# EAGLE design Motor-Driver-Breakout (EAGLE 9.6.2)
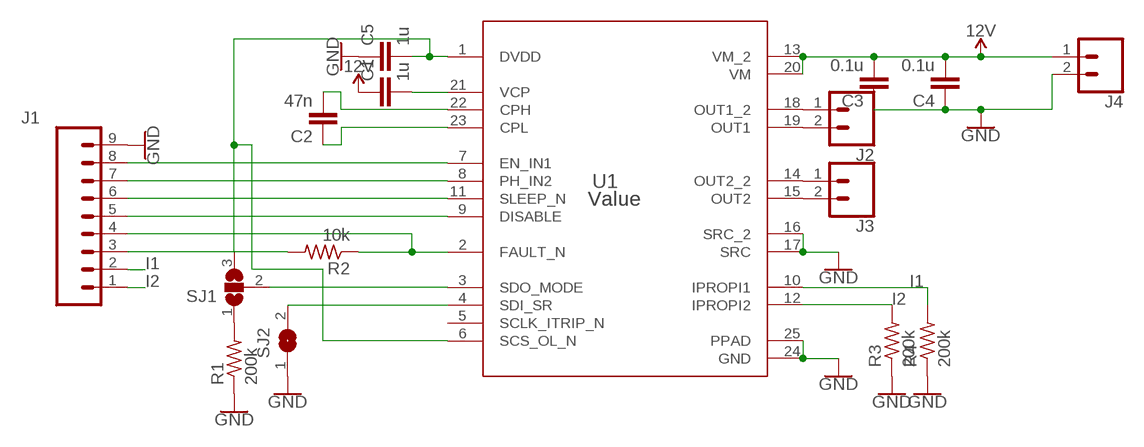
[diagram p0: schematic, sheet 1]

## Parts
C1  1u  C0603  [0603-C]
C2  47n  C0603  [0603-C]
C3  0.1u  C0603  [0603-C]
C4  0.1u  C0603  [0603-C]
C5  1u  C0603  [0603-C]
J1  CONN_09  [1X09]
J2  CONN_02  [1X02]
J3  CONN_02  [1X02]
J4  CONN_02  [1X02]
R1  200k  R0603  [0603-R]
R2  10k  R0603  [0603-R]
R3  200k  R0603  [0603-R]
R4  200k  R0603  [0603-R]
SJ1  SJ2W  [SJ_2]
SJ2  SJ  [SJ]
U1  Value  DRV8873HPWPRQ1  [PWP0024J_N]

## Nets
12V: C1.1 C3.2 C4.2 J4.1 U1.13(VM_2) U1.20(VM)
GND: C3.1 C4.1 C5.1 J1.9 J4.2 R1.1 R3.1 R4.1 SJ2.1 U1.16(SRC_2) U1.17(SRC) U1.24(GND) U1.25(PPAD)
I1: J1.2 R4.2 U1.10(IPROPI1)
I2: J1.1 R3.2 U1.12(IPROPI2)
N$1: SJ1.2 U1.3(SDO_MODE)
N$2: R1.2 SJ1.1
N$3: J1.4 R2.1 U1.2(FAULT_N)
N$4: C5.2 SJ1.3 U1.1(DVDD) U1.6(SCS_OL_N)
N$5: C1.2 U1.21(VCP)
N$6: C2.2 U1.22(CPH)
N$7: C2.1 U1.23(CPL)
N$8: J2.1 U1.18(OUT1_2)
N$9: SJ2.2 U1.4(SDI_SR)
N$10: J2.2 U1.19(OUT1)
N$11: J1.6 U1.11(SLEEP_N)
N$12: J1.8 U1.7(EN_IN1)
N$13: J1.7 U1.8(PH_IN2)
N$14: J1.5 U1.9(DISABLE)
N$15: J1.3 R2.2
N$16: J3.1 U1.14(OUT2_2)
N$17: J3.2 U1.15(OUT2)
Unconnected: U1.5(SCLK_ITRIP_N)

## Library data of the parts
C1-C5 = comma.ai:C
J1 = SparkFun-Connectors:CONN_09: Multi connection point. Often used as Generic Header-pin footprint for 0.1 inch spaced/style header connections On any of the 0.1 inch spaced packages, you can populate with these: Break Away Headers - Straight <https://www.sparkfun.com/products/116> (PRT-00116) Break Away Male Headers - Right Angle <https://www.sparkfun.com/products/553> (PRT-00553) Female Headers <https://www.sparkfun.com/products/115> (PRT-00115) Break Away Headers - Machine Pin <https://www.sparkfun.com/products/117> (PRT-00117) Break Away Female Headers - Swiss Machine Pin <https://www.sparkfun.com/products/743> (PRT-00743) For SCREWTERMINALS and SPRING TERMINALS visit here: Screw Terimnals on SparkFun.com <https://www.sparkfun.com/search/results?term=Screw+Terminals> (5mm/3.5mm/2.54mm spacing) This device is also useful as a general connection point to wire up your design to another part of your project. Our various solder wires solder well into these plated through hole pads. Hook-Up Wire - Assortment (Stranded, 22 AWG) <https://www.sparkfun.com/products/11375> (PRT-11375) Hook-Up Wire - Assortment (Solid Core, 22 AWG) <https://www.sparkfun.com/products/11367> (PRT-11367) View the entire wire category on our website here <https://www.sparkfun.com/categories/141> Special notes: Molex polarized connector foot print use with SKU : PRT-08231 with associated crimp pins and housings. 1MM SMD Version SKU: PRT-10208 NOTES ON THE VARIANTS LOCK and LOCK_LONGPADS... This footprint was designed to help hold the alignment of a through-hole component (i.e. 6-pin header) while soldering it into place. You may notice that each hole has been shifted either up or down by 0.005 of an inch from it's more standard position (which is a perfectly straight line). This slight alteration caused the pins (the squares in the middle) to touch the edges of the holes. Because they are alternating, it causes a "brace" to hold the component in place. 0.005 has proven to be the perfect amount of "off-center" position when using our standard breakaway headers. Although looks a little odd when you look at the bare footprint, once you have a header in there, the alteration is very hard to notice. Also,if you push a header all the way into place, it is covered up entirely on the bottom side.
J2-J4 = SparkFun-Connectors:CONN_02: Multi connection point. Often used as Generic Header-pin footprint for 0.1 inch spaced/style header connections On any of the 0.1 inch spaced packages, you can populate with these: Break Away Headers - Straight <https://www.sparkfun.com/products/116> (PRT-00116) Break Away Male Headers - Right Angle <https://www.sparkfun.com/products/553> (PRT-00553) Female Headers <https://www.sparkfun.com/products/115> (PRT-00115) Break Away Headers - Machine Pin <https://www.sparkfun.com/products/117> (PRT-00117) Break Away Female Headers - Swiss Machine Pin <https://www.sparkfun.com/products/743> (PRT-00743) For SCREWTERMINALS and SPRING TERMINALS visit here: Screw Terimnals on SparkFun.com <https://www.sparkfun.com/search/results?term=Screw+Terminals> (5mm/3.5mm/2.54mm spacing) This device is also useful as a general connection point to wire up your design to another part of your project. Our various solder wires solder well into these plated through hole pads. Hook-Up Wire - Assortment (Stranded, 22 AWG) <https://www.sparkfun.com/products/11375> (PRT-11375) Hook-Up Wire - Assortment (Solid Core, 22 AWG) <https://www.sparkfun.com/products/11367> (PRT-11367) View the entire wire category on our website here <https://www.sparkfun.com/categories/141> Special notes: Molex polarized connector foot print use with: PRT-08233 with associated crimp pins and housings. 2.54_SCREWTERM for use with PRT-10571. 3.5mm Screw Terminal footprints for PRT-08084 5mm Screw Terminal footprints for use with PRT-08432
R1-R4 = comma.ai:R
SJ1 = jumper:SJ2W: SMD solder JUMPER
SJ2 = jumper:SJ: SMD solder JUMPER
U1 = comma.ai:DRV8873HPWPRQ1; MANUFACTURER: Texas Instruments; PARTNUMBER: DRV8873SPWPRQ1; REFDES: RefDes; TYPE: TYPE

## Board
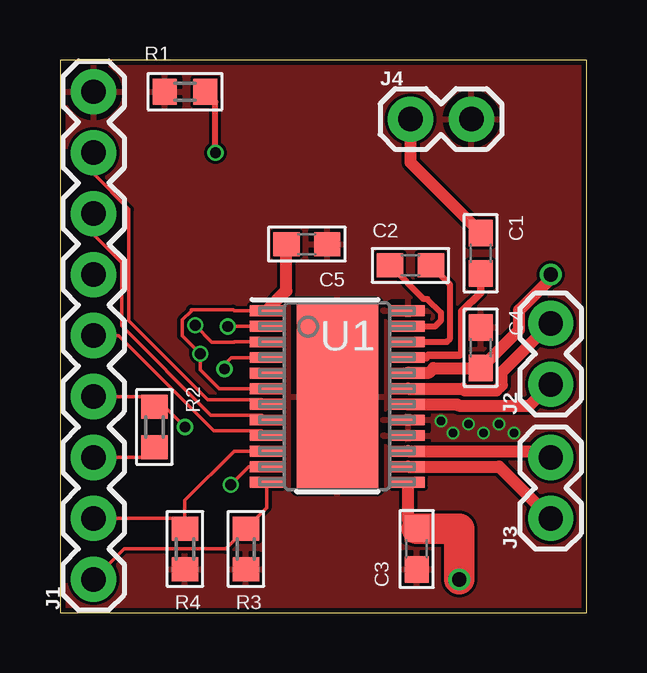
[diagram p1: board, top side]
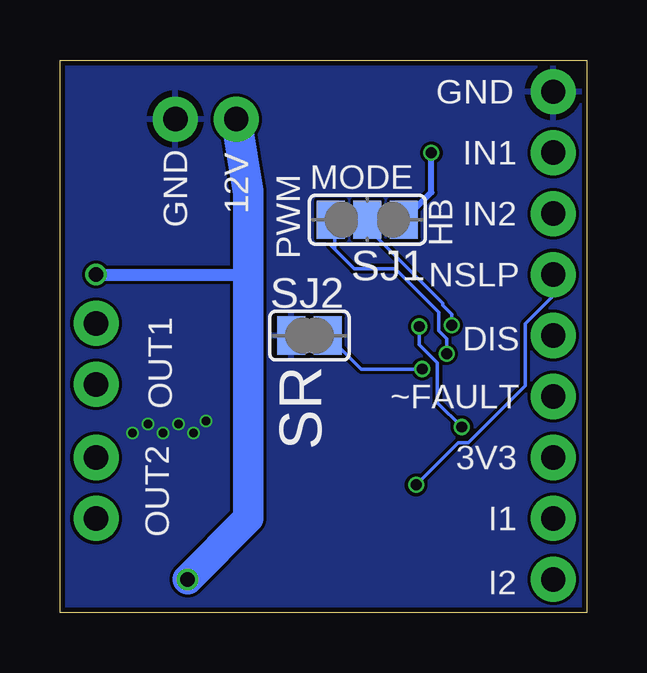
[diagram p2: board, bottom side, seen from below]

Size 21.95 x 23.04 mm. Coordinates in mm from the lower left corner, seen from the top.
Outline: 0,0 21.95,0 21.95,23.04 0,23.04 0,0
Copper layers (1*16): Top 0.035559375mm / dielectric 1.6mm / Bottom 0.035559375mm
Design rules "jlcpcb2layer": minimum track width 5mil, minimum drill 12mil, track to track 5mil, track to pad 5mil, pad to pad 5mil, via to via 5mil, smd to smd 5mil, copper to edge 8mil, drill to drill 6mil, minimum pad ring 5mil, minimum via ring 3mil, stop-mask expansion 2.5mil, vias tented up to drill 0mil, thermal gap 10mil

### Footprints (pad centres in the part's own frame; a part is rotated, then mirrored left to right if it is on the bottom)
0603-C = smd 1.1 x 1: 1 -0.85,0; 2 0.85,0
1X09 = drill 1.016 pad 1.88: 1 0,0; 2 2.54,0; 3 5.08,0; 4 7.62,0; 5 10.16,0; 6 12.7,0; 7 15.24,0; 8 17.78,0; 9 20.32,0
1X02 = drill 1.016 pad 1.88: 1 0,0; 2 2.54,0
0603-R = smd 1 x 1.1: 1 -0.85,0; 2 0.85,0
SJ_2 = smd 1.168 x 1.6: 1 -1.524,0; 2 0,0; 3 1.524,0
SJ = smd 1.168 x 1.6: 1 -0.762,0; 2 0.762,0
PWP0024J_N = smd 1.4 x 0.45: 1 -2.95,3.575; 2 -2.95,2.925; 3 -2.95,2.275; 4 -2.95,1.625; 5 -2.95,0.975; 6 -2.95,0.325; 7 -2.95,-0.325; 8 -2.95,-0.975; 9 -2.95,-1.625; 10 -2.95,-2.275; 11 -2.95,-2.925; 12 -2.95,-3.575; 13 2.95,-3.575; 14 2.95,-2.925; 15 2.95,-2.275; 16 2.95,-1.625; 17 2.95,-0.975; 18 2.95,-0.325; 19 2.95,0.325; 20 2.95,0.975; 21 2.95,1.625; 22 2.95,2.275; 23 2.95,2.925; 24 2.95,3.575 | smd 3.4 x 7.8: 25 0,0 | smd 0.5 x 0.5: V -1,0

### Placement (x,y rotation side)
C1  17.53,14.99 270 top
C2  14.6,14.48 0 top
C3  14.86,2.67 90 top
C4  17.53,11.05 270 top
C5  10.29,15.37 180 top
J1  1.4,1.4 90 top
J2  20.45,9.53 90 top
J3  20.45,3.94 90 top
J4  14.6,20.57 0 top
R1  5.21,21.72 0 top
R2  3.94,7.75 270 top
R3  7.75,2.67 90 top
R4  5.21,2.67 90 top
SJ1  9.14,16.38 180 bottom
SJ2  11.56,11.56 0 bottom
U1  11.56,9.02 0 top

### Tracks (layer width: path | path; a pad name or v marks a point on that pad's centre or on a via)
12V  (via drill 0.6)
  Top 0.152: C3.2 14.51,3.87
  Top 0.508: 14.51,3.87 U1.13 | U1.20 14.53,10.01 15.38,10.01 15.56,10.2 C4.2 19.13,11.8 19.13,12.61 20.45,13.93 v20.45,14.1 | C1.1 14.6,18.76 J4.1
  Top 1.27: C3.2 16.64,3.52 v16.64,1.4
  Bottom 0.508: v20.45,14.1 14.1,14.1
  Bottom 1.27: v16.64,1.4 14.1,3.94 14.1,14.1 14.1,17.53 J4.1
GND  (via drill 0.35)
  other vias: 15.88,8 16.38,7.49 17.02,7.87 17.65,7.49 18.29,7.87 18.92,7.49
  pour Top: 0.13,22.99 21.97,22.99 21.97,0 0,0 0,22.99
  pour Bottom: 0.13,22.99 21.97,22.99 21.97,0 0,0 0,22.99
I1
  Top 0.152: U1.10 7.25,6.74 5.21,4.7 R4.2 4.79,3.94 J1.2
I2
  Top 0.152: U1.12 8.61,4.38 R3.2 6.9,2.67 2.67,2.67 J1.1
N$1  (via drill 0.45)
  Top 0.152: U1.3 7.27,11.29 7.26,11.28 6.33,11.28 v5.63,11.98
  Bottom 0.152: SJ1.2 9.14,16.04 6.01,12.91 6.01,12.83 5.63,12.45 v5.63,11.98
N$2  (via drill 0.45)
  Top 0.254: v6.48,19.18 6.48,21.3 R1.2
  Bottom 0.254: SJ1.1 6.48,17.53 v6.48,19.18
N$3  (via drill 0.45)
  Top 0.152: J1.4 3.52,9.02 R2.1 4.36,8.6 v5.21,7.75 | v6.99,11.94 U1.2
  Bottom 0.152: v5.21,7.75 6.22,8.76 6.22,10.41 6.99,11.18 v6.99,11.94
N$4  (via drill 0.45)
  Top 0.152: U1.6 6.64,9.34 5.84,10.14 v5.84,10.8 5.09,11.55 5.09,12.21 5.46,12.58 5.46,12.64 7.21,12.64 7.26,12.59 U1.1
  Top 0.508: U1.1 9.44,13.42 C5.2
  Bottom 0.152: 10.67,15.31 10.51,15.15 | 10.51,15.15 9.7,14.34 7.99,14.34 6.17,12.52 6.17,11.76 5.84,11.43 v5.84,10.8 | 10.51,15.15 10.51,16.22 SJ1.3
N$5
  Top 0.305: U1.21 15.25,10.64 15.34,10.73 16.64,10.73 16.75,10.84 16.75,12.56 17.53,13.34 C1.2
N$6
  Top 0.254: U1.22 16.12,11.29 16.26,11.43 16.26,13.68 C2.2
N$7
  Top 0.254: U1.23 15.62,11.94 15.88,12.19 15.88,12.51 15.31,13.07 15.16,13.07 C2.1
N$8
  Top 0.508: U1.18 16.55,8.69 16.61,8.63 19.55,8.63 J2.1
N$9  (via drill 0.45)
  Top 0.152: U1.4 7.14,10.64 6.86,10.36 v6.86,10.16
  Bottom 0.152: v6.86,10.16 9.4,10.16 SJ2.2
N$10
  Top 0.508: U1.19 16.79,9.34 16.87,9.27 18.18,9.27 18.41,9.49 18.41,10.03 J2.2
N$11  (via drill 0.45)
  Top 0.152: U1.11 7.87,6.09 v7.11,5.33
  Bottom 0.152: v7.11,5.33 5.36,7.09 4.94,7.09 2.57,9.46 2.57,12.04 1.4,13.21 J1.6
N$12
  Top 0.152: U1.7 8.41,8.89 6.16,8.89 2.87,12.18 2.87,16.82 1.4,18.29 J1.8
N$13
  Top 0.152: U1.8 8.41,8.24 6.29,8.24 2.57,11.96 2.57,14.58 1.4,15.75 J1.7
N$14
  Top 0.152: U1.9 8.41,7.59 6.42,7.59 2.45,11.56 J1.5
N$15
  Top 0.152: R2.2 3.52,6.48 J1.3
N$16
  Top 0.508: U1.14 18.29,6.09 J3.1
N$17
  Top 0.508: U1.15 20.18,6.74 J3.2

### Text on the board
bNames: GND | IN1 | 12V | GND | MODE | PWM | IN2 | HB | NSLP | DIS | SR | ~FAULT | OUT1 | 3V3 | I1 | OUT2 | I2